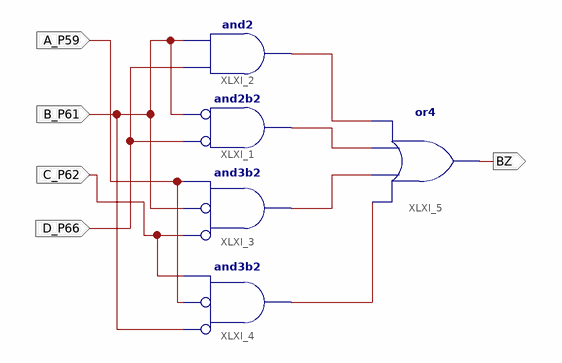
[diagram p0: schematic sheet 1]
// Xilinx ISE schematic Lab4.sch (spartan6) as structural Verilog: 5 symbols, 5 ports
module Lab4 (
  input  A_P59,
  input  B_P61,
  input  D_P66,
  input  C_P62,
  output BZ
);

  wire XLXN_2, XLXN_8, XLXN_9, XLXN_10;

  and XLXI_1 (XLXN_8, ~D_P66, ~B_P61);  // and2b2
  and XLXI_2 (XLXN_2, D_P66, B_P61);
  and XLXI_3 (XLXN_9, ~C_P62, ~B_P61, A_P59);  // and3b2
  and XLXI_4 (XLXN_10, ~B_P61, ~A_P59, C_P62);  // and3b2
  or XLXI_5 (BZ, XLXN_10, XLXN_9, XLXN_8, XLXN_2);
endmodule
